# Altium schematic sheet Sensor Board.SchDoc
size A3; ApprovedBy: OLD SCHOOL; CheckedBy: UDEMY; Revision: AA; SheetNumber: 5; SheetTotal: 5; Department: R&D Hardware; Size: A3; RreparedBy: M.Mesih ÇELİK; ReleaseDate: 24.10.2021; ChangedDate: 26.10.2021; BoardDescription: Wireless Security Detector
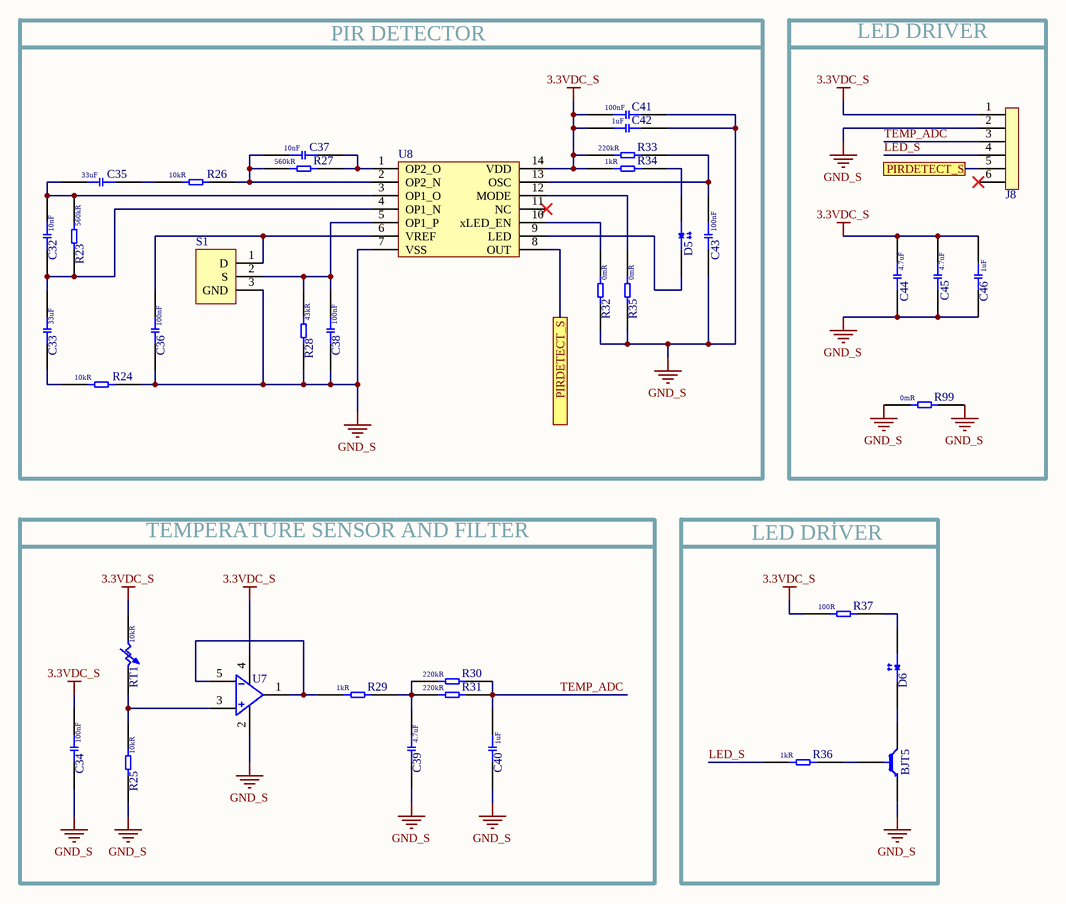
[diagram p0: Sensor Board.SchDoc]

## Parts
BJT5  MMBT3904-7-F  [SOT-23F]  (value not drawn)
C32  Capacitance: 10nF  [CAP_0603]  (hidden comment: 0603B103K500CT)
C33  Capacitance: 33uF  [CAP_1206]  (hidden comment: C3216X5R1E336M160AC)
C34  Capacitance: 100nF  [CAP_0603]  (hidden comment: C0603C104K5RACTU)
C35  Capacitance: 33uF  [CAP_1206]  (hidden comment: C3216X5R1E336M160AC)
C36  Capaticante: 100nF  [CAP_0603]  (hidden comment: ALA7DF471CF450)
C37  Capacitance: 10nF  [CAP_0603]  (hidden comment: 0603B103K500CT)
C38  Capaticante: 100nF  [CAP_0603]  (hidden comment: ALA7DF471CF450)
C39  Capacitance: 4.7uF  [CAP_0805]  (hidden comment: CL21A475KAQNNNE)
C40  Capacitance: 1uF  [CAP_0805]  (hidden comment: CL21B105KBFNNNE)
C41  Capaticante: 100nF  [CAP_0603]  (hidden comment: ALA7DF471CF450)
C42  Capacitance: 1uF  [CAP_0805]  (hidden comment: CL21B105KBFNNNE)
C43  Capaticante: 100nF  [CAP_0603]  (hidden comment: ALA7DF471CF450)
C44  Capacitance: 4.7uF  [CAP_0805]  (hidden comment: CL21A475KAQNNNE)
C45  Capacitance: 4.7uF  [CAP_0805]  (hidden comment: CL21A475KAQNNNE)
C46  Capacitance: 1uF  [CAP_0805]  (hidden comment: CL21B105KBFNNNE)
D5  LTST-C171GKT  [LED_0805_GREEN]  (value not drawn)
D6  LH R974-LP-1-0-20-R18  [LED_0805_RED]  (value not drawn)
J8  64800611622  [64800611622]  (value not drawn)
R23  Resistance: 560kR  [RES_0603]  (hidden comment: RC0603JR-07560KL)
R24  Resistance: 10kR  [RES_0603]  (hidden comment: RC0201FR-0710KL)
R25  Resistance: 10kR  [RES_0603]  (hidden comment: RC0201FR-0710KL)
R26  Resistance: 10kR  [RES_0603]  (hidden comment: RC0201FR-0710KL)
R27  Resistance: 560kR  [RES_0603]  (hidden comment: RC0603JR-07560KL)
R28  Resistance: 43kR  [RES_0603]  (hidden comment: RC0603JR-0743KL)
R29  Resistance: 1kR  [RES_0603]  (hidden comment: RC0603FR-101KL)
R30  Resistance: 220kR  [RES_0603]  (hidden comment: RC0603JR-07220KL)
R31  Resistance: 220kR  [RES_0603]  (hidden comment: RC0603JR-07220KL)
R32  Resistance: 0mR  [RES_0603]  (hidden comment: RC0603JR-070RL)
R33  Resistance: 220kR  [RES_0603]  (hidden comment: RC0603JR-07220KL)
R34  Resistance: 1kR  [RES_0603]  (hidden comment: RC0603FR-101KL)
R35  Resistance: 0mR  [RES_0603]  (hidden comment: RC0603JR-070RL)
R36  Resistance: 1kR  [RES_0603]  (hidden comment: RC0603FR-101KL)
R37  Resistance: 100R  [RES_0603]  (hidden comment: RC0603JR-07100RL)
R99  Resistance: 0mR  [RES_0603]  (hidden comment: RC0603JR-070RL)
RT1  Resistance: 10kR  [RES_1206]  (hidden comment: TFPT1206L1002FM)
S1  LHI 878/3902  [LHI 878/3902 - PYD 1388 / 708]  (value not drawn)
U7  OPA314AIDBVR  [SOT23-5]  (value not drawn)
U8  NCS36000DRG  [SOIC14]  (value not drawn)

## Blocks framed on the sheet
PIR DETECTOR: C32 C33 C35-C38 C41-C43 D5 R23 R24 R26-R28 R32-R35 S1 U8
LED DRİVER: C44-C46 J8 R99
TEMPERATURE SENSOR AND FILTER: C34 C39 C40 R25 R29-R31 RT1 U7
LED DRİVER: BJT5 D6 R36 R37

## Ports
PIRDETECT_S (see Sensor Board[3B]), PIRDETECT_S (see Sensor Board[4A])

## Nets
3.3VDC_S: C34.2 C41.2 C42.2 C44.2 C45.2 C46.2 J8.1 R33.2 R34.2 R37.2 RT1.1 U7.4(V+) U8.14(VDD)
GND_S: BJT5.2(E) C34.1 C36.1 C38.1 C39.1 C40.1 C41.1 C42.1 C43.1 C44.1 C45.1 C46.1 J8.2 R24.1 R25.1 R28.1 R32.1 R35.1 R99.1 R99.2 S1.3(GND) U7.2(V-) U8.7(VSS)
LED_S: J8.4 R36.1
PIRDETECT_S: J8.5 U8.8(OUT) ; port PIRDETECT_S
TEMP_ADC: C40.2 J8.3 R30.2 R31.2
NetBJT5_1: BJT5.1(B) R36.2
NetBJT5_3: BJT5.3(C) D6.1
NetC32_1: C32.1 C33.1 R23.1 U8.4(OP1_N)
NetC32_2: C32.2 C35.1 R23.2 U8.3(OP1_O)
NetC33_2: C33.2 R24.2
NetC35_2: C35.2 R26.1
NetC36_2: C36.2 S1.1(D) U8.6(VREF)
NetC37_1: C37.1 R26.2 R27.1 U8.2(OP2_N)
NetC37_2: C37.2 R27.2 U8.1(OP2_O)
NetC38_2: C38.2 R28.2 S1.2(S) U8.5(OP1_P)
NetC39_2: C39.2 R29.2 R30.1 R31.1
NetC43_2: C43.2 R33.1 U8.13(OSC)
NetD5_1: D5.1 U8.9(LED)
NetD5_2: D5.2 R34.1
NetD6_2: D6.2 R37.1
NetR25_2: R25.2 RT1.2 U7.3(+IN)
NetR29_1: R29.1 U7.1(OUT) U7.5(-IN)
NetR32_2: R32.2 U8.10(xLED_EN)
NetR35_2: R35.2 U8.12(MODE)

Not connected (* = marked no-connect by the designer): J8 6*; U8 11(NC)*

## Notes on the sheet
- DOSYA ADI / FILE NAME
- TANIM / DESCRIPTION
- HAZIRLAYAN / PREPARED BY
- YAYIN TARİHİ / REL. DATE
- ONAYLAYAN / APPROVED BY
- KONTROL EDEN / CHECKED BY
- BÖLÜM / DEPARTMENT
- BOYUT / SIZE
- DEĞ. TARİHİ / CHANGE DATE
- REVİZYON / REVISION
- SAYFA / SHEET
- /

## Library data of the parts
BJT5 = MMBT3904-7-F: TRANS NPN 40V 0.2A SMD SOT23-3; Manufacturer: Diodes Zetex; Designed by: M.C; Max Power Dissipation: 300mW; Max Collector Current: 200mA; Collector Base Voltage (VCBO): 60V; Frequency: 300MHz; hFE Min: 100; Number of Elements: 1; Emitter Base Voltage (VEBO): 6V; Collector Emitter Saturation Voltage: 300mV; Power Dissipation: 350mW; Element Configuration: Single; Supplier 1: Digi-Key; Manufacturer Part Number: MMBT3904-7-F; RoHS: Yes; Category: BJTs; Pricing 1: 3000=0,02271, 6000=0,02048, 15000=0,01781, 30000=0,01603, 75000=0,01425 (USD); Mount: Surface Mount; Case/Package: SOT-23; Number of Pins: 3; Weight: 0.000282oz; Contact Plating: Tin,Matte; Min Operating Temperature: -55°C; Max Operating Temperature: 150°C; Collector Emitter Voltage (VCEO): 40V; Polarity: NPN; Packaging: Tape and Reel; Package Quantity: 3000; Transition Frequency: 300MHz; Collector Emitter Breakdown Voltage: 40V; Max Breakdown Voltage: 40V; Continuous Collector Current: 200mA; Max Frequency: 300MHz; Gain Bandwidth Product: 300MHz; Series: -; Collector-emitter Voltage-Max: 300mV; Voltage Rating (DC): 40V; Length: 3.05mm; Width: 1.4mm; Height: 1mm; Radiation Hardening: No; REACH SVHC: No SVHC; Lead Free: Lead Free; RoHS Compliant: Yes; ComponentLink1URL: https://datasheet.ciiva.com/11201/ds30036-11201778.pdf?src-supplier=Avnet; ComponentLink1Description: https://datasheet.ciiva.com/11201/ds30036-11201778.pdf?src-supplier=Avnet; ComponentLink2URL: https://datasheet.ciiva.com/15138/getdatasheetpartid-53265-15138780.pdf?src-supplier=Verical; ComponentLink2Description: https://datasheet.ciiva.com/15138/getdatasheetpartid-53265-15138780.pdf?src-supplier=Verical; ComponentLink3URL: https://datasheet.ciiva.com/22711/1915516-22711750.pdf?src-supplier=Element14; ComponentLink3Description: https://datasheet.ciiva.com/22711/1915516-22711750.pdf?src-supplier=Element14; ComponentLink4URL: https://datasheet.ciiva.com/11198/ds30036-11198999.pdf?src-supplier=Avnet; ComponentLink4Description: https://datasheet.ciiva.com/11198/ds30036-11198999.pdf?src-supplier=Avnet; ComponentLink5URL: https://datasheet.ciiva.com/6361/ds30036-6361256.pdf?src-supplier=Digi-Key; ComponentLink5Description: https://datasheet.ciiva.com/6361/ds30036-6361256.pdf?src-supplier=Digi-Key; ComponentLink6URL: https://datasheet.ciiva.com/6361/ds30036-6361254.pdf?src-supplier=Digi-Key; ComponentLink6Description: https://datasheet.ciiva.com/6361/ds30036-6361254.pdf?src-supplier=Digi-Key; Supplier Part Number 1: MMBT3904-FDITR-ND
C32 C37 = CAP 10nF 0603: WALSIN - 0603B103K500CT - CAP, 0.01µF, 50V, 10%, X7R, 0603; Manufacturer: Walsin Technologies; Designed by: M.C; Dissipation Factor: 2.5%; Insulation Resistance: 10GR; Case/Package: 0603; Supplier 1: Digi-Key; Manufacturer Part Number: 0603B103K500CT; RoHS: Yes; Category: Ceramic Capacitors; Stock 1: 1056108; Pricing 1: 1=0,10000, 10=0,02800, 50=0,01520, 100=0,01240, 500=0,00886, 1000=0,00696 (USD); Case Code (Imperial): 0603; Case Code (Metric): 1608; Min Operating Temperature: -55°C; Max Operating Temperature: 125°C; Voltage Rating: 50V; Tolerance: 10%; Packaging: Tape and Reel; Voltage Rating (DC): 50V; Dielectric: X7R; Package Quantity: 4000; Termination: SMD/SMT; Length: 1.6mm; Width: 0.8mm; Height: 0.8mm; Depth: 0.8mm; Radiation Hardening: No; REACH SVHC: Unknown; Lead Free: Lead Free; RoHS Compliant: Yes; ComponentLink1URL: https://datasheet.ciiva.com/18161/getdatasheetpartid-87505-18161959.pdf?src-supplier=Verical; ComponentLink1Description: https://datasheet.ciiva.com/18161/getdatasheetpartid-87505-18161959.pdf?src-supplier=Verical; Supplier Part Number 1: 1292-1386-1-ND
C33 C35 = CAP  33uF 1206: Cap Ceramic 33uF 25V X5R 20% SMD 1206 85C T/R; Manufacturer: TDK; Designed by: M.C; Supplier 1: Digi-Key; Manufacturer Part Number: C3216X5R1E336M160AC; RoHS: Yes; Category: Ceramic Capacitors; Pricing 1: 2000=0,40250 (USD); Mount: Surface Mount; Case/Package: 1206; Case Code (Metric): 3216; Case Code (Imperial): 1206; Weight: 0.000571oz; Dielectric Material: Ceramic; Min Operating Temperature: -55°C; Max Operating Temperature: 85°C; Voltage Rating: 25V; Tolerance: 20%; Packaging: Tape and Reel; Termination: SMD/SMT; Series: C; Package Quantity: 1; Voltage Rating (DC): 25V; Dielectric: X5R; Resistor Type: Ceramic; Length: 3.2mm; Width: 0.063inch; Depth: 1.6mm; Thickness: 1.6mm; REACH SVHC: No SVHC; Lead Free: Lead Free; RoHS Compliant: Yes; ComponentLink1URL: https://datasheet.ciiva.com/24216/c3216x5r1e336m160ac-265051-24216512.pdf?src-supplier=Mouser; ComponentLink1Description: https://datasheet.ciiva.com/24216/c3216x5r1e336m160ac-265051-24216512.pdf?src-supplier=Mouser; ComponentLink2URL: https://datasheet.ciiva.com/6285/tdkmlcccaprange-6285278.pdf?src-supplier=Digi-Key; ComponentLink2Description: https://datasheet.ciiva.com/6285/tdkmlcccaprange-6285278.pdf?src-supplier=Digi-Key; Supplier 2: Farnell; Stock 2: 10883; Pricing 2: 5=0,84200, 50=0,51700, 250=0,45400, 500=0,39100, 1000=0,34400 (GBP); Supplier Part Number 1: 445-8046-2-ND; Supplier Part Number 2: 2525171
C34 = CAP 100nF 0603: Multilayer Ceramic Capacitors (MLCC) - SMD/SMT 50volts 0.1uF X7R 10%; Manufacturer: KEMET; Designed by: M.C; Voltage Rating (DC): 50V; Dissipation Factor: 2.5%; Supplier 1: Digi-Key; Manufacturer Part Number: C0603C104K5RACTU; RoHS: Yes; Category: Ceramic Capacitors; Stock 1: 6388973; Pricing 1: 4000=0,01852 (USD); Mount: Surface Mount; Case/Package: 0603; Number of Pins: 2; Case Code (Metric): 1608; Case Code (Imperial): 0603; Dielectric Material: Ceramic; Contact Plating: Tin,Matte; Min Operating Temperature: -55°C; Max Operating Temperature: 125°C; Tolerance: 10%; Packaging: Tape and Reel; Package Quantity: 1; Dielectric: X7R; Termination: SMD/SMT; Voltage: 50V; Voltage Rating: 50V; Series: SMD Comm X7R; Length: 0.063inch; Width: 0.031inch; Height: 0.8mm; Thickness: 0.034inch; Lead Pitch: 0.7mm; Depth: 0.8mm; Radiation Hardening: No; RoHS Compliant: Yes; REACH SVHC: No SVHC; ComponentLink1URL: https://datasheet.ciiva.com/7823/kem-c1002-x7r-smd-7823591.pdf?src-supplier=Element14; ComponentLink1Description: https://datasheet.ciiva.com/7823/kem-c1002-x7r-smd-7823591.pdf?src-supplier=Element14; ComponentLink2URL: https://datasheet.ciiva.com/7823/kem-c1002-x7r-smd-7823592.pdf?src-supplier=Element14; ComponentLink2Description: https://datasheet.ciiva.com/7823/kem-c1002-x7r-smd-7823592.pdf?src-supplier=Element14; ComponentLink3URL: https://datasheet.ciiva.com/5999/kem-c1002-x7r-smd-5999400.pdf?src-supplier=Farnell; ComponentLink3Description: https://datasheet.ciiva.com/5999/kem-c1002-x7r-smd-5999400.pdf?src-supplier=Farnell; ComponentLink4URL: https://datasheet.ciiva.com/28645/1851736-28645640.pdf?src-supplier=Element14; ComponentLink4Description: https://datasheet.ciiva.com/28645/1851736-28645640.pdf?src-supplier=Element14; ComponentLink5URL: https://datasheet.ciiva.com/14585/70095383-14585209.pdf?src-supplier=Allied+Electronics; ComponentLink5Description: https://datasheet.ciiva.com/14585/70095383-14585209.pdf?src-supplier=Allied+Electronics; ComponentLink6URL: https://datasheet.ciiva.com/14602/70095383-14602583.pdf?src-supplier=Allied+Electronics; ComponentLink6Description: https://datasheet.ciiva.com/14602/70095383-14602583.pdf?src-supplier=Allied+Electronics; Supplier 2: RSComponents; Stock 2: 55000; Pricing 2: 1000=0,03000 (GBP); Supplier Part Number 2: 8015347; Supplier Part Number 1: 399-C0603C104K5RAC7867TR-ND
C36 C38 C41 C43 = CAP 100nf 0603_1: CAP CER 100nF %10 0603 SMD; Manufacturer: KEMET; Designed by: M.C; Supplier 1: Digi-Key; Manufacturer Part Number: ALA7DF471CF450; RoHS: No; Pricing 1: 1120=5,49651 (USD); Supplier Part Number 1: ALA7DF471CF450-ND; Case/Package: 0603
C39 C44 C45 = CAP 4.7uF 0805: SAMSUNG ELECTRO-MECHANICS - CL21A475KAQNNNE - SMD Multilayer Ceramic Capacitor, 4.7 µF, 25 V, 0805 [2012 Metric], ± 10%, X5R, CL Series; Designed by: M.C; Voltage Rating: 25V; Supplier 1: Digi-Key; Manufacturer: Samsung; Manufacturer Part Number: CL21A475KAQNNNE; RoHS: Yes; Category: Ceramic Capacitors; Pricing 1: 2000=0,02103 (USD); Mount: Surface Mount; Case/Package: 0805; Case Code (Metric): 2012; Case Code (Imperial): 0805; Min Operating Temperature: -55°C; Max Operating Temperature: 85°C; Package Quantity: 1; Packaging: Tape and Reel; Tolerance: 10%; Dielectric: X5R; Voltage Rating (DC): 25V; Series: CL; Construction: Flat; Length: 2mm; Width: 0.049inch; Height: 1.25mm; Thickness: 0.055inch; Depth: 1.25mm; Radiation Hardening: No; Lead Free: Lead Free; RoHS Compliant: Yes; ComponentLink1URL: https://datasheet.ciiva.com/25798/cl21a475kaqnnne-25798882.pdf?src-supplier=Digi-Key; ComponentLink1Description: https://datasheet.ciiva.com/25798/cl21a475kaqnnne-25798882.pdf?src-supplier=Digi-Key; Supplier 2: Mouser; Stock 2: 6240; Pricing 2: 1=0,12000, 10=0,05700, 50=0,05700, 100=0,04100, 500=0,03000, 1000=0,02500, 2000=0,02300, 4000=0,01800, 10000=0,01600 (USD); Supplier Part Number 1: 1276-1244-2-ND; Supplier Part Number 2: 187-CL21A475KAQNNNE
C40 C42 C46 = CAP 1uF 0805: SAMSUNG ELECTRO-MECHANICS - CL21B105KBFNNNE - SMD Multilayer Ceramic Capacitor, 1 µF, 50 V, 0805 [2012 Metric], ± 10%, X7R, CL Series; Designed by: M.C; Voltage Rating: 50V; Supplier 1: Digi-Key; Manufacturer: Samsung; Manufacturer Part Number: CL21B105KBFNNNE; RoHS: Yes; Category: Ceramic Capacitors; Pricing 1: 2000=0,02295 (USD); Mount: Surface Mount; Case/Package: 0805; Case Code (Metric): 2012; Case Code (Imperial): 0805; Min Operating Temperature: -55°C; Max Operating Temperature: 125°C; Tolerance: 10%; Packaging: Tape and Reel; Package Quantity: 1; Dielectric: X7R; Voltage: 50V; Series: CL; Construction: Flat; Length: 2mm; Width: 0.049inch; Height: 1.25mm; Thickness: 0.053inch; Depth: 1.25mm; Radiation Hardening: No; RoHS Compliant: Yes; ComponentLink1URL: https://datasheet.ciiva.com/25800/cl21b105kbfnnne-25800291.pdf?src-supplier=Digi-Key; ComponentLink1Description: https://datasheet.ciiva.com/25800/cl21b105kbfnnne-25800291.pdf?src-supplier=Digi-Key; ComponentLink2URL: https://datasheet.ciiva.com/16449/cl21b105kbfnnne-16449003.pdf?src-supplier=Future+Electronics; ComponentLink2Description: https://datasheet.ciiva.com/16449/cl21b105kbfnnne-16449003.pdf?src-supplier=Future+Electronics; ComponentLink3URL: https://datasheet.ciiva.com/26838/getdatasheetpartid-354075-26838668.pdf?src-supplier=Verical; ComponentLink3Description: https://datasheet.ciiva.com/26838/getdatasheetpartid-354075-26838668.pdf?src-supplier=Verical; Supplier Part Number 1: 1276-1029-2-ND
D5 = LTST-C171GKT: Green 0805 130 º Min 5 mcd Typical 12 mcd Water Clear Lens SMT LED; Manufacturer: Vishay Lite-On; Designed by: M.C; Lens Color: Colorless; Viewing Angle: 130°; Lens Style: Diffused,Colorless,Rectangular,Clear; Luminous Intensity: 12mcd; Forward Current: 30mA; Forward Voltage: 2.1V; Power Rating: 100mW; Dominant Wavelength: 569nm; Test Current: 10mA; Number of Elements: 1; Wavelength: 585nm; Reverse Voltage: 5V; Supplier 1: Digi-Key; Manufacturer Part Number: LTST-C171GKT; RoHS: Yes; Category: LEDs; Stock 1: 152855; Pricing 1: 3000=0,04646, 6000=0,04040, 15000=0,03636, 30000=0,03232, 75000=0,02929 (USD); Mount: Surface Mount; Case/Package: 0805; Number of Pins: 2; Color: Green; Case Code (Metric): 2012; Case Code (Imperial): 0805; Min Operating Temperature: -55°C; Max Operating Temperature: 85°C; Package Quantity: 1; Packaging: Tape and Reel; Illumination Color: Green; Lens Transparency: Clear; Power Dissipation: 100mW; Number of LEDs: 1; Series: CHIPLED 0805; Length: 2mm; Width: 1.25mm; Height: 0.8mm; Depth: 1.25mm; Radiation Hardening: No; Lead Free: Lead Free; RoHS Compliant: Yes; ComponentLink1URL: https://datasheet.ciiva.com/2110/ltst-c171gkt-2110000.pdf?src-supplier=Digi-Key; ComponentLink1Description: https://datasheet.ciiva.com/2110/ltst-c171gkt-2110000.pdf?src-supplier=Digi-Key; ComponentLink2URL: https://datasheet.ciiva.com/11773/0900766b80dc0296-11773991.pdf?src-supplier=RSComponents; ComponentLink2Description: https://datasheet.ciiva.com/11773/0900766b80dc0296-11773991.pdf?src-supplier=RSComponents; ComponentLink3URL: https://datasheet.ciiva.com/12400/lite-on-ltst-c171gkt-190133-12400647.pdf?src-supplier=Mouser; ComponentLink3Description: https://datasheet.ciiva.com/12400/lite-on-ltst-c171gkt-190133-12400647.pdf?src-supplier=Mouser; ComponentLink4URL: https://datasheet.ciiva.com/2110/ltst-c171gkt-2110001.pdf?src-supplier=Digi-Key; ComponentLink4Description: https://datasheet.ciiva.com/2110/ltst-c171gkt-2110001.pdf?src-supplier=Digi-Key; ComponentLink5URL: https://datasheet.ciiva.com/2110/ltst-c171gkt-2110002.pdf?src-supplier=Digi-Key; ComponentLink5Description: https://datasheet.ciiva.com/2110/ltst-c171gkt-2110002.pdf?src-supplier=Digi-Key; ComponentLink6URL: https://datasheet.ciiva.com/16396/ltst-c171gkt-16396549.pdf?src-supplier=Future+Electronics; ComponentLink6Description: https://datasheet.ciiva.com/16396/ltst-c171gkt-16396549.pdf?src-supplier=Future+Electronics; Supplier Part Number 1: 160-1423-2-ND
D6 = LH R974-LP-1-0-20-R18: Single Color LED, Hyper Red, Colorless Diffused, 1.3mm; Manufacturer: Osram Opto; Designed by: M.C; Viewing Angle: 160°; Wavelength: 660nm; Luminous Intensity: 15mcd; Forward Voltage: 1.8V; Supplier 1: Digi-Key; Manufacturer Part Number: LHR974-LP-1-0-20-R18; RoHS: Yes; Category: LEDs; Case/Package: 0805; Lens Style: Diffused; Lead Free: Lead Free; RoHS Compliant: Yes; ComponentLink1URL: https://www.verical.com/server-webapp/html/getDatasheet?partID=752067&src-supplier=Verical; ComponentLink1Description: https://www.verical.com/server-webapp/html/getDatasheet?partID=752067&src-supplier=Verical; Supplier Part Number 1: 475-LHR974-LP-1-0-20-R18TR-ND
J8 = 64800611622: 1.50mm 6PIN Connector; Manufacturer: Wurth Electronics; Designed by: M.C; Supplier 1: RSComponents; Manufacturer Part Number: 64800611622; RoHS: No; Stock 1: 160; Pricing 1: 10=0,39600, 50=0,36600, 200=0,34000, 500=0,31800 (GBP); Supplier Part Number 1: 2138727; Case/Package: 64800611622
R23 R27 = RES 560kR OHM 0603: RES SMD 560K OHM 5% 1/10W 0603; Manufacturer: Yageo; Designed by: M.C; Power Rating: 100mW; Voltage Rating: 75V; Voltage Rating (DC): 50V; Temperature Coefficient: 100ppm/°C; Supplier 1: Digi-Key; Manufacturer Part Number: RC0603JR-07560KL; RoHS: Yes; Category: Chip SMD Resistors; Stock 1: 610000; Pricing 1: 5000=0,00258 (USD); Case/Package: 0603; Number of Pins: 2; Case Code (Metric): 1608; Case Code (Imperial): 0603; Weight: 7.1E-05oz; Min Operating Temperature: -55°C; Max Operating Temperature: 155°C; Package Quantity: 1; Tolerance: 5%; Packaging: Tape and Reel; Resistor Type: Thick Film; Number of Terminations: 2; Termination: SMD/SMT; Max Power Dissipation: 100mW; Working Voltage: 75V; Features: Moisture Resistant; Series: RC; Resistance Tolerance: 5%; Construction: Rectangular; Technology: THICK FILM; Length: 1.6mm; Width: 0.8mm; Height: 0.022inch; Depth: 0.8mm; REACH SVHC: Unknown; Military Standard: Not; Lead Free: Lead Free; RoHS Compliant: Yes; ComponentLink1URL: https://datasheet.ciiva.com/2453/pyu-r-int-thick-7-2453056.pdf?src-supplier=Digi-Key; ComponentLink1Description: https://datasheet.ciiva.com/2453/pyu-r-int-thick-7-2453056.pdf?src-supplier=Digi-Key; ComponentLink2URL: https://datasheet.ciiva.com/2453/pyu-r-int-thick-7-2453057.pdf?src-supplier=Digi-Key; ComponentLink2Description: https://datasheet.ciiva.com/2453/pyu-r-int-thick-7-2453057.pdf?src-supplier=Digi-Key; ComponentLink3URL: https://datasheet.ciiva.com/2453/pyu-r-int-thick-7-2453055.pdf?src-supplier=Digi-Key; ComponentLink3Description: https://datasheet.ciiva.com/2453/pyu-r-int-thick-7-2453055.pdf?src-supplier=Digi-Key; Supplier Part Number 1: 311-560KGRTR-ND
R24-R26 = RES 10K OHM 0603: GENERAL 0201 11% REEL (7INCH); Manufacturer: Yageo; Designed by: M.C; Tolerance: 1%; Temperature Coefficient: 200ppm/°C; Power Rating: 50mW; Voltage Rating: 25V; Supplier 1: Digi-Key; Manufacturer Part Number: RC0201FR-0710KL; RoHS: Yes; Category: Chip SMD Resistors; Stock 1: 2049260; Pricing 1: 1=0,10000, 10=0,04200, 100=0,01700, 1000=0,00765, 2500=0,00664, 5000=0,00548 (USD); Case/Package: 0603; Number of Pins: 2; Contact Plating: Tin,Matte; Case Code (Imperial): 0201; Case Code (Metric): 0603; Weight: 6E-06oz; Min Operating Temperature: -55°C; Max Operating Temperature: 125°C; Resistor Type: Thick Film; Packaging: Tape and Reel; Package Quantity: 1; Termination: SMD/SMT; Number of Terminations: 2; Max Power Dissipation: 50mW; Voltage Rating (DC): 25V; Working Voltage: 25V; Features: Moisture Resistant; Series: RC; Technology: THICK FILM; Resistance Tolerance: 1%; Construction: Rectangular; Length: 0.6mm; Width: 0.3mm; Height: 0.01inch; Depth: 0.3mm; Radiation Hardening: No; REACH SVHC: No SVHC; Military Standard: Not; Lead Free: Lead Free; RoHS Compliant: Yes; ComponentLink1URL: https://datasheet.ciiva.com/2467/pyu-r-int-thick-7-2467109.pdf?src-supplier=Digi-Key; ComponentLink1Description: https://datasheet.ciiva.com/2467/pyu-r-int-thick-7-2467109.pdf?src-supplier=Digi-Key; ComponentLink2URL: https://datasheet.ciiva.com/2467/pyu-r-int-thick-7-2467110.pdf?src-supplier=Digi-Key; ComponentLink2Description: https://datasheet.ciiva.com/2467/pyu-r-int-thick-7-2467110.pdf?src-supplier=Digi-Key; ComponentLink3URL: https://datasheet.ciiva.com/2467/pyu-r-int-thick-7-2467111.pdf?src-supplier=Digi-Key; ComponentLink3Description: https://datasheet.ciiva.com/2467/pyu-r-int-thick-7-2467111.pdf?src-supplier=Digi-Key; ComponentLink4URL: https://datasheet.ciiva.com/7660/1421516-7660807.pdf?src-supplier=Element14; ComponentLink4Description: https://datasheet.ciiva.com/7660/1421516-7660807.pdf?src-supplier=Element14; ComponentLink5URL: https://datasheet.ciiva.com/8891/pyu-rc0201-51-rohs-l-8-8891384.pdf?src-supplier=Avnet; ComponentLink5Description: https://datasheet.ciiva.com/8891/pyu-rc0201-51-rohs-l-8-8891384.pdf?src-supplier=Avnet; ComponentLink6URL: https://datasheet.ciiva.com/28405/pyu-rc0201-51-rohs-l-8-28405609.pdf?src-supplier=Avnet+Europe; ComponentLink6Description: https://datasheet.ciiva.com/28405/pyu-rc0201-51-rohs-l-8-28405609.pdf?src-supplier=Avnet+Europe; ComponentLink7URL: https://datasheet.ciiva.com/26829/getdatasheetpartid-421074-26829851.pdf?src-supplier=Verical; ComponentLink7Description: https://datasheet.ciiva.com/26829/getdatasheetpartid-421074-26829851.pdf?src-supplier=Verical; ComponentLink8URL: https://datasheet.ciiva.com/46391/1421516-46391339.pdf?src-supplier=Element14; ComponentLink8Description: https://datasheet.ciiva.com/46391/1421516-46391339.pdf?src-supplier=Element14; ComponentLink9URL: https://datasheet.ciiva.com/16855/pyu-rc0201-51-rohs-l-8-16855789.pdf?src-supplier=Avnet+Europe; ComponentLink9Description: https://datasheet.ciiva.com/16855/pyu-rc0201-51-rohs-l-8-16855789.pdf?src-supplier=Avnet+Europe; Supplier Part Number 1: 311-10.0KMCT-ND
R28 = RES 43kR OHM 0603: Resistor;Resistance:43Kohm;Resistance Tolerance:± 5%;Resistor Element Material:Thick Film;Resistor Case Style:0603; Manufacturer: Yageo; Designed by: M.C; Voltage Rating: 75V; Power Rating: 100mW; Temperature Coefficient: 100ppm/°C; Voltage Rating (DC): 50V; Supplier 1: Digi-Key; Manufacturer Part Number: RC0603JR-0743KL; RoHS: Yes; Category: Chip SMD Resistors; Stock 1: 10000; Pricing 1: 5000=0,00258 (USD); Case/Package: 0603; Case Code (Imperial): 0603; Case Code (Metric): 1608; Weight: 7.1E-05oz; Min Operating Temperature: -55°C; Max Operating Temperature: 155°C; Tolerance: 5%; Packaging: Tape and Reel; Package Quantity: 1; Termination: SMD/SMT; Resistor Type: Thick Film; Number of Terminations: 2; Max Power Dissipation: 100mW; Working Voltage: 75V; Features: Moisture Resistant; Series: RC; Construction: Rectangular; Technology: THICK FILM; Length: 1.6mm; Width: 0.8mm; Height: 0.022inch; Depth: 0.8mm; Military Standard: Not; Lead Free: Lead Free; RoHS Compliant: Yes; ComponentLink1URL: https://datasheet.ciiva.com/2453/pyu-r-int-thick-7-2453052.pdf?src-supplier=Digi-Key; ComponentLink1Description: https://datasheet.ciiva.com/2453/pyu-r-int-thick-7-2453052.pdf?src-supplier=Digi-Key; ComponentLink2URL: https://datasheet.ciiva.com/2453/pyu-r-int-thick-7-2453053.pdf?src-supplier=Digi-Key; ComponentLink2Description: https://datasheet.ciiva.com/2453/pyu-r-int-thick-7-2453053.pdf?src-supplier=Digi-Key; ComponentLink3URL: https://datasheet.ciiva.com/2453/pyu-r-int-thick-7-2453054.pdf?src-supplier=Digi-Key; ComponentLink3Description: https://datasheet.ciiva.com/2453/pyu-r-int-thick-7-2453054.pdf?src-supplier=Digi-Key; Supplier Part Number 1: 311-43KGRTR-ND
R29 R34 R36 = RES 1kR OHM 0603: Res Thick Film 0603 1K Ohm 1% 0.1W(1/10W) ±100ppm/C Pad SMD T/R; Manufacturer: Yageo; Temperature Coefficient: 100ppm/°C; Power Rating: 100mW; Voltage Rating: 50V; Designed by: M.C; Supplier 1: Digi-Key; Manufacturer Part Number: RC0603FR-101KL; RoHS: Yes; Category: Chip SMD Resistors; Stock 1: 46; Pricing 1: 1=0,10000, 10=0,02400, 100=0,00970, 1000=0,00436, 2500=0,00378, 5000=0,00312 (USD); Case/Package: 0603; Number of Pins: 2; Contact Plating: Tin,Lead,Matte; Case Code (Imperial): 0603; Case Code (Metric): 1608; Min Operating Temperature: -55°C; Max Operating Temperature: 155°C; Tolerance: 1%; Resistor Type: Thick Film; Packaging: Tape and Reel; Termination: SMD/SMT; Voltage Rating (DC): 50V; Series: RC; Construction: Rectangular; Resistance Tolerance: 1%; Length: 1.6mm; Width: 0.8mm; Height: 0.45mm; Depth: 0.8mm; Radiation Hardening: No; REACH SVHC: Unknown; Military Standard: Not; RoHS Compliant: Yes; ComponentLink1URL: https://datasheet.ciiva.com/12560/rc0603-272842-12560633.pdf?src-supplier=Mouser; ComponentLink1Description: https://datasheet.ciiva.com/12560/rc0603-272842-12560633.pdf?src-supplier=Mouser; ComponentLink2URL: https://datasheet.ciiva.com/7983/443971-7983659.pdf?src-supplier=Element14; ComponentLink2Description: https://datasheet.ciiva.com/7983/443971-7983659.pdf?src-supplier=Element14; Supplier Part Number 1: 13-RC0603FR-101KLCT-ND
R30 R31 R33 = RES 220kR OHM 0603: YAGEO - RC0603JR-07220KL - Resistencia SMD de Tipo Chip, 0603 [Métrica 1608], 220 kohm, RC Series, 75 V, Película Gruesa; Designed by: M.C; Tolerance: 5%; Temperature Coefficient: 100ppm/°C; Voltage Rating (DC): 50V; Power Rating: 100mW; Supplier 1: Digi-Key; Manufacturer: Yageo; Manufacturer Part Number: RC0603JR-07220KL; RoHS: Yes; Category: Chip SMD Resistors; Stock 1: 90000; Pricing 1: 5000=0,00258 (USD); Case/Package: 0603; Number of Pins: 2; Case Code (Imperial): 0603; Case Code (Metric): 1608; Size Code: 0603; Min Operating Temperature: -55°C; Max Operating Temperature: 155°C; Resistor Type: Thick Film; Packaging: Tape and Reel; Voltage Rating: 50V; Package Quantity: 1; Termination: SMD/SMT; Number of Terminations: 2; Max Power Dissipation: 100mW; Features: Moisture Resistant; Series: RC; Construction: Rectangular; Resistance Tolerance: 5%; Length: 1.6mm; Width: 0.031inch; Height: 0.022inch; Depth: 0.8mm; REACH SVHC: No SVHC; Lead Free: Lead Free; RoHS Compliant: Yes; Military Standard: Not; ComponentLink1URL: https://datasheet.ciiva.com/2452/pyu-r-int-thick-7-2452923.pdf?src-supplier=Digi-Key; ComponentLink1Description: https://datasheet.ciiva.com/2452/pyu-r-int-thick-7-2452923.pdf?src-supplier=Digi-Key; ComponentLink2URL: https://datasheet.ciiva.com/2452/pyu-r-int-thick-7-2452924.pdf?src-supplier=Digi-Key; ComponentLink2Description: https://datasheet.ciiva.com/2452/pyu-r-int-thick-7-2452924.pdf?src-supplier=Digi-Key; ComponentLink3URL: https://datasheet.ciiva.com/2452/pyu-r-int-thick-7-2452925.pdf?src-supplier=Digi-Key; ComponentLink3Description: https://datasheet.ciiva.com/2452/pyu-r-int-thick-7-2452925.pdf?src-supplier=Digi-Key; Supplier Part Number 1: 311-220KGRTR-ND
R32 R35 R99 = RES 0mR OHM 0603: RES SMD 0 OHM JUMPER 1/10W 0603; Manufacturer: Yageo; Designed by: M.C; Tolerance: 1%; Power Rating: 100mW; Voltage Rating (DC): 50V; Temperature Coefficient: 200ppm/°C; Resistance Tolerance: 5%; Supplier 1: Digi-Key; Manufacturer Part Number: RC0603JR-070RL; RoHS: Yes; Category: Chip SMD Resistors; Stock 1: 1697200; Pricing 1: 5000=0,00224, 10000=0,00195, 25000=0,00171, 50000=0,00160 (USD); Case/Package: 0603; Number of Pins: 2; Contact Plating: Tin,Matte; Case Code (Imperial): 0603; Case Code (Metric): 1608; Size Code: 0603; Min Operating Temperature: -55°C; Max Operating Temperature: 155°C; Resistor Type: Thick Film; Packaging: Tape and Reel; Termination: SMD/SMT; Series: RC; Technology: THICK FILM; Package Quantity: 5000; Voltage Rating: 50V; Features: Moisture Resistant; Max Power Dissipation: 100mW; Number of Terminations: 2; Construction: Rectangular; Length: 1.6mm; Width: 0.8mm; Height: 0.45mm; Depth: 0.8mm; Radiation Hardening: No; REACH SVHC: No SVHC; Lead Free: Lead Free; RoHS Compliant: Yes; Military Standard: Not; Supplier Part Number 1: 311-0.0GRTR-ND
R37 = RES 100R OHM 0603: Res Thick Film 0603 100 Ohm 5% 0.1W(1/10W) ±100ppm/C Molded SMD Paper T/R; Manufacturer: Yageo; Designed by: M.C; Temperature Coefficient: 100ppm/°C; Voltage Rating (DC): 50V; Power Rating: 100mW; Supplier 1: Digi-Key; Manufacturer Part Number: RC0603JR-07100RL; RoHS: Yes; Category: Chip SMD Resistors; Stock 1: 387967; Pricing 1: 5000=0,00258 (USD); Case/Package: 0603; Number of Pins: 2; Contact Plating: Tin,Matte; Case Code (Imperial): 0603; Case Code (Metric): 1608; Size Code: 0603; Min Operating Temperature: -55°C; Max Operating Temperature: 155°C; Tolerance: 5%; Resistor Type: Thick Film; Packaging: Tape and Reel; Voltage Rating: 50V; Termination: SMD/SMT; Features: Moisture Resistant; Series: RC; Max Power Dissipation: 100mW; Number of Terminations: 2; Construction: Rectangular; Resistance Tolerance: 5%; Length: 1.6mm; Width: 0.8mm; Depth: 0.8mm; Radiation Hardening: No; REACH SVHC: Unknown; Lead Free: Lead Free; Military Standard: Not; RoHS Compliant: Yes; ComponentLink1URL: https://datasheet.ciiva.com/7746/443971-7746425.pdf?src-supplier=Element14; ComponentLink1Description: https://datasheet.ciiva.com/7746/443971-7746425.pdf?src-supplier=Element14; ComponentLink2URL: https://datasheet.ciiva.com/7746/443971-7746426.pdf?src-supplier=Element14; ComponentLink2Description: https://datasheet.ciiva.com/7746/443971-7746426.pdf?src-supplier=Element14; ComponentLink3URL: https://datasheet.ciiva.com/8883/pyu-rc0603-51-rohs-l-4-8883047.pdf?src-supplier=Avnet; ComponentLink3Description: https://datasheet.ciiva.com/8883/pyu-rc0603-51-rohs-l-4-8883047.pdf?src-supplier=Avnet; ComponentLink4URL: https://datasheet.ciiva.com/15189/getdatasheetpartid-325207-15189846.pdf?src-supplier=Verical; ComponentLink4Description: https://datasheet.ciiva.com/15189/getdatasheetpartid-325207-15189846.pdf?src-supplier=Verical; Supplier Part Number 1: 311-100GRTR-ND
RT1 = TFPT1206L1002FM: Thermistor PTC 10K Ohm 1% 2-Pin 1206 Surface Mount Solder Pad T/R Automotive; Manufacturer: Vishay Dale; Power Rating: 125mW; Voltage: 40V; Designed by: M.C; Supplier 1: Digi-Key; Manufacturer Part Number: TFPT1206L1002FM; RoHS: Yes; Category: Thermistors; Stock 1: 15000; Pricing 1: 5000=0,50325 (USD); Mount: Surface Mount; Case/Package: 1206; Number of Pins: 2; Min Operating Temperature: -55°C; Max Operating Temperature: 125°C; Packaging: Tape and Reel; Package Quantity: 5000; Tolerance: 1%; Max Power Dissipation: 125mW; Termination: SMD/SMT; Series: TFPT; Resistance Tolerance: 1%; Length: 3.2mm; Width: 1.6mm; Height: 0.55mm; Depth: 1.6mm; Lead Free: Lead Free; RoHS Compliant: Yes; ComponentLink1URL: https://datasheet.ciiva.com/2852/tfpt-2852076.pdf?src-supplier=Digi-Key; ComponentLink1Description: https://datasheet.ciiva.com/2852/tfpt-2852076.pdf?src-supplier=Digi-Key; Supplier Part Number 1: 541-3533-2-ND
S1 = LHI 878/3902: PYD 1388 / 7083 SENSOR PYRO DETECTOR DUAL MOTION; Manufacturer: Excelitas; Designed by: M.C; Responsivity: 4.2 kV/W (typical); Noise (typical): 20µVpp; Noise (max): 50µVpp; Operation requirements: 2.0-10V; Output Type: Analog; Supplier 1: Newark; RoHS: No; Supplier Part Number 1: 61T6571; Housing with optical window: TO-5; Manufacturer Part Number: LHI878/3902; Case/Package: LHI; Supplier 2: Digi-Key; Supplier Part Number 2: 1601-LHI878/3902-ND
U7 = OPA314AIDBVR: Op Amp; Manufacturer: Texas Instruments; Designed by: M.C; Min Supply Voltage: 1.8V; Max Supply Voltage: 5.5V; Min Dual Supply Voltage: 900mV; Max Dual Supply Voltage: 2.75V; Voltage Gain: 128dB; Common Mode Rejection Ratio: 75dB; Gain Bandwidth Product: 3MHz; Output Current: 20mA; Nominal Supply Current: 150uA; Number of Channels: 1; Slew Rate: 1.5V/µs; Max I/O Voltage: 2.5mV; Input Bias Current: 10pA; Power Supply Rejection Ratio (PSRR): 78dB; Amplifier Type: GENERAL PURPOSE; Supplier 1: Digi-Key; Manufacturer Part Number: OPA314AIDBVR; RoHS: Yes; Category: Amplifiers - Op Amps, Buffer, Instrumentation; Pricing 1: 3000=0,60725 (USD); Case/Package: SOT-23-5; Number of Pins: 5; Contact Plating: Gold; Min Operating Temperature: -40°C; Max Operating Temperature: 125°C; Package Quantity: 1; Packaging: Tape and Reel; Unity Gain Bandwidth Product: 3MHz; Nominal Gain Bandwidth Product: 3MHz; Input Offset Voltage (Vos): 2.5mV; Operating Supply Current: 150uA; Number of Circuits: 1; Output Current per Channel: 20mA; Number of Elements: 1; Supply Current: 150uA; Series: -; Technology: CMOS; Radiation Hardening: No; Lead Free: Lead Free; RoHS Compliant: Yes; ComponentLink1URL: https://datasheet.ciiva.com/14462/opa2314-14462006.pdf?src-supplier=Avnet; ComponentLink1Description: https://datasheet.ciiva.com/14462/opa2314-14462006.pdf?src-supplier=Avnet; ComponentLink2URL: https://datasheet.ciiva.com/26226/opa2314-26226295.pdf?src-supplier=Avnet+Europe; ComponentLink2Description: https://datasheet.ciiva.com/26226/opa2314-26226295.pdf?src-supplier=Avnet+Europe; ComponentLink3URL: https://datasheet.ciiva.com/14456/opa2314-14456281.pdf?src-supplier=Avnet; ComponentLink3Description: https://datasheet.ciiva.com/14456/opa2314-14456281.pdf?src-supplier=Avnet; ComponentLink4URL: https://datasheet.ciiva.com/29638/opa314-29638827.pdf?src-supplier=Digi-Key; ComponentLink4Description: https://datasheet.ciiva.com/29638/opa314-29638827.pdf?src-supplier=Digi-Key; Supplier Part Number 1: 296-36699-2-ND
U8 = NCS36000DRG: Low Noise Amplifiers and LDO Regulator 14-Pin SOIC N T/R; Manufacturer: ON Semiconductor; Operating Supply Current: 50uA; Quiescent Current: 20uA; Min Supply Voltage: 3V; Max Supply Voltage: 5.75V; Output Type: Digital; Designed by: M.C; Supplier 1: Digi-Key; Manufacturer Part Number: NCS36000DRG; RoHS: Yes; Category: Amplifiers - Op Amps, Buffer, Instrumentation; Stock 1: 18000; Pricing 1: 3000=0,54337 (USD); Case/Package: SOIC; Number of Pins: 14; Min Operating Temperature: -40°C; Max Operating Temperature: 85°C; Package Quantity: 1; Packaging: Tape and Reel; Series: -; Input Type: DIGITAL; Length: 8.75mm; Width: 4mm; Height: 1.5mm; Radiation Hardening: No; REACH SVHC: No SVHC; Lead Free: Lead Free; Halogen Free: Halogen Free; RoHS Compliant: Yes; ComponentLink1URL: https://datasheet.ciiva.com/1781/ncs36000-d-1781637.pdf?src-supplier=Digi-Key; ComponentLink1Description: https://datasheet.ciiva.com/1781/ncs36000-d-1781637.pdf?src-supplier=Digi-Key; ComponentLink2URL: https://datasheet.ciiva.com/4763/ncs36000-d-89569-4763639.pdf?src-supplier=Mouser; ComponentLink2Description: https://datasheet.ciiva.com/4763/ncs36000-d-89569-4763639.pdf?src-supplier=Mouser; ComponentLink3URL: https://datasheet.ciiva.com/1781/ncs36000-d-1781638.pdf?src-supplier=Digi-Key; ComponentLink3Description: https://datasheet.ciiva.com/1781/ncs36000-d-1781638.pdf?src-supplier=Digi-Key; ComponentLink4URL: https://datasheet.ciiva.com/1781/ncs36000-d-1781639.pdf?src-supplier=Digi-Key; ComponentLink4Description: https://datasheet.ciiva.com/1781/ncs36000-d-1781639.pdf?src-supplier=Digi-Key; ComponentLink5URL: https://datasheet.ciiva.com/26166/ncs36000-d-26166711.pdf?src-supplier=Avnet+Europe; ComponentLink5Description: https://datasheet.ciiva.com/26166/ncs36000-d-26166711.pdf?src-supplier=Avnet+Europe; ComponentLink6URL: https://datasheet.ciiva.com/2965/ncs36000-d-2965212.pdf?src-supplier=Avnet; ComponentLink6Description: https://datasheet.ciiva.com/2965/ncs36000-d-2965212.pdf?src-supplier=Avnet; ComponentLink7URL: https://datasheet.ciiva.com/2966/ncs36000-d-2966525.pdf?src-supplier=Avnet; ComponentLink7Description: https://datasheet.ciiva.com/2966/ncs36000-d-2966525.pdf?src-supplier=Avnet; Supplier Part Number 1: NCS36000DRGOSTR-ND